# EAGLE design XStepperLCD (EAGLE 6.4)
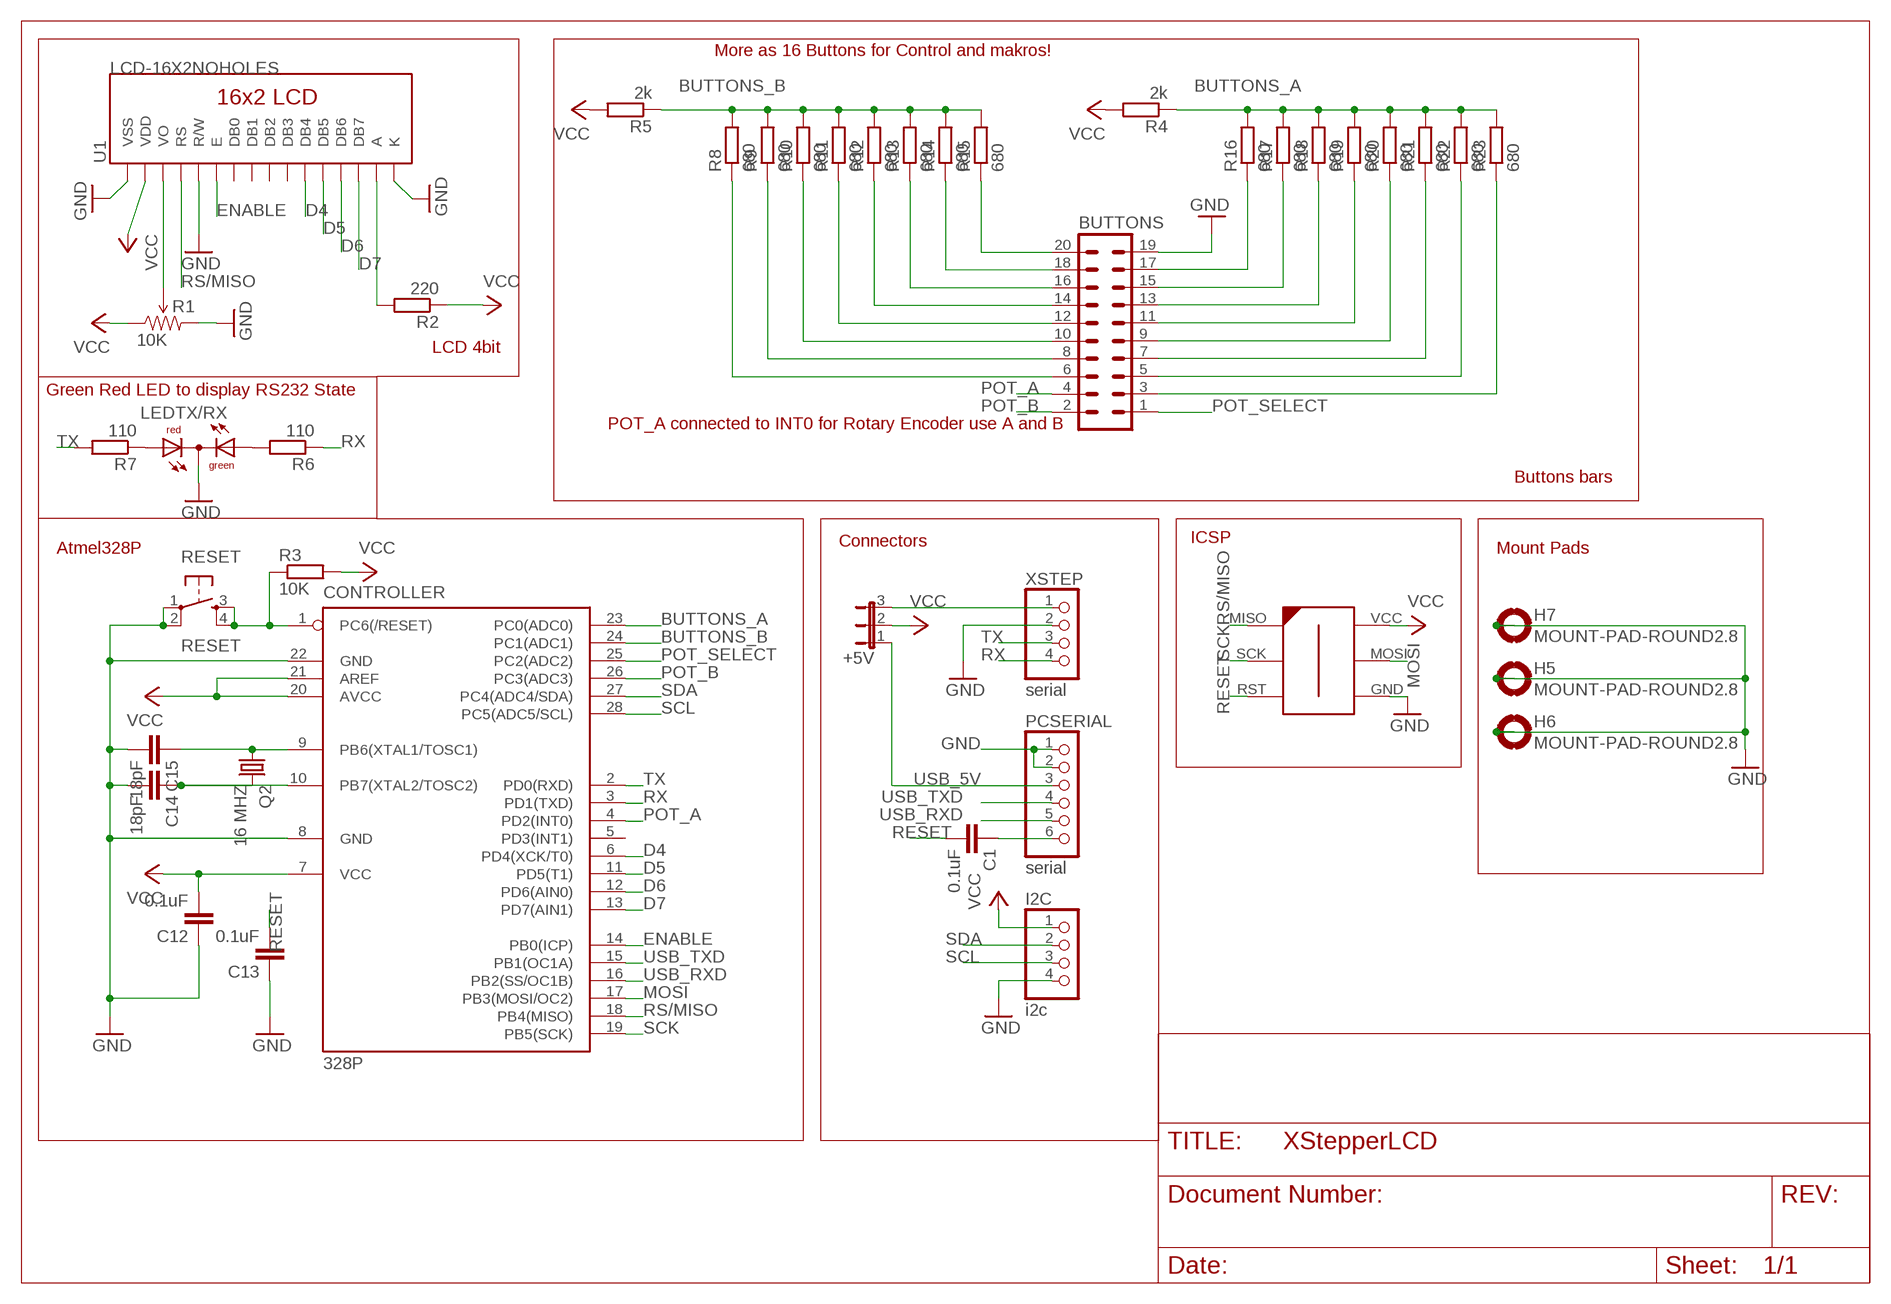
[diagram p0: schematic, sheet 1]

## Parts
328P  CONTROLLER  MEGA8-P  [DIL28-3]
+5V  JP2E  [JP2]
BUTTONS  ML20  [ML20]
C1  0.1uF  C-EUC1206  [C1206]
C12  0.1uF  C-EUC1206K  [C1206K]
C13  0.1uF  C-EUC1206  [C1206]
C14  18pF  C-EU025-025X050  [C025-025X050]
C15  18pF  C-EU025-025X050  [C025-025X050]
H5  MOUNT-PAD-ROUND2.8  [2,8-PAD]
H6  MOUNT-PAD-ROUND2.8  [2,8-PAD]
H7  MOUNT-PAD-ROUND2.8  [2,8-PAD]
I2C  i2c  PINHD-1X4/90  [1X04/90]
ICSP  ICSP  AVR-ISP-6-EDGE  [6PAD_ISP]
LEDTX/RX  DUOLED2X5  [DUOLED2X5]
PCSERIAL  serial  PINHD-1X6/90  [1X06/90]
Q2  16 MHZ  CRYSTALHC49S  [HC49/S]
R1  10K  TRIMPOT3362U-2  [3362U-2]
R2  220  R-EU_R1206  [R1206]
R3  10K  R-EU_R1206  [R1206]
R4  2k  R-EU_R1206  [R1206]
R5  2k  R-EU_R1206  [R1206]
R6  110  R-EU_R1206  [R1206]
R7  110  R-EU_R1206  [R1206]
R8  680  R-EU_R1206  [R1206]
R9  680  R-EU_R1206  [R1206]
R10  680  R-EU_R1206  [R1206]
R11  680  R-EU_R1206  [R1206]
R12  680  R-EU_R1206  [R1206]
R13  680  R-EU_R1206  [R1206]
R14  680  R-EU_R1206  [R1206]
R15  680  R-EU_R1206  [R1206]
R16  680  R-EU_R1206  [R1206]
R17  680  R-EU_R1206  [R1206]
R18  680  R-EU_R1206  [R1206]
R19  680  R-EU_R1206  [R1206]
R20  680  R-EU_R1206  [R1206]
R21  680  R-EU_R1206  [R1206]
R22  680  R-EU_R1206  [R1206]
R23  680  R-EU_R1206  [R1206]
RESET  RESET  TAC_SWITCHPTH  [TACTILE-PTH]
U1  LCD-16X2NOHOLES  [LCD-16X2_NOHOLES]
XSTEP  serial  PINHD-1X4/90  [1X04/90]

## Nets
BUTTONS_A: 328P.23(PC0(ADC0)) R4.1 R16.2 R17.2 R18.2 R19.2 R20.2 R21.2 R22.2 R23.2
BUTTONS_B: 328P.24(PC1(ADC1)) R5.1 R8.2 R9.2 R10.2 R11.2 R12.2 R13.2 R14.2 R15.2
D4: 328P.6(PD4(XCK/T0)) U1.11(DB4)
D5: 328P.11(PD5(T1)) U1.12(DB5)
D6: 328P.12(PD6(AIN0)) U1.13(DB6)
D7: 328P.13(PD7(AIN1)) U1.14(DB7)
ENABLE: 328P.14(PB0(ICP)) U1.6(E)
GND: 328P.8(GND) 328P.22(GND) BUTTONS.19 C12.1 C13.1 C14.2 C15.2 H5.B2,8(MOUNT) H6.B2,8(MOUNT) H7.B2,8(MOUNT) I2C.4 ICSP.GND LEDTX/RX.K(C) PCSERIAL.1 PCSERIAL.2 R1.3(CW) RESET.1 RESET.2 U1.1(VSS) U1.5(R/W) U1.16(K) XSTEP.2
MOSI: 328P.17(PB3(MOSI/OC2)) ICSP.MOSI
N$1: R1.2(WIPER) U1.3(VO)
N$2: R2.2 U1.15(A)
N$4: BUTTONS.13 R18.1
N$5: BUTTONS.15 R17.1
N$6: BUTTONS.17 R16.1
N$7: BUTTONS.6 R8.1
N$8: BUTTONS.8 R9.1
N$9: BUTTONS.3 R23.1
N$10: BUTTONS.5 R22.1
N$11: BUTTONS.10 R10.1
N$12: BUTTONS.12 R11.1
N$13: BUTTONS.14 R12.1
N$14: C1.1 PCSERIAL.6
N$15: BUTTONS.16 R13.1
N$16: BUTTONS.7 R21.1
N$17: BUTTONS.9 R20.1
N$18: BUTTONS.11 R19.1
N$19: BUTTONS.18 R14.1
N$20: BUTTONS.20 R15.1
N$21: LEDTX/RX.AG R6.2
N$22: LEDTX/RX.AR R7.1
N$33: 328P.9(PB6(XTAL1/TOSC1)) C15.1 Q2.1
N$34: 328P.10(PB7(XTAL2/TOSC2)) C14.1 Q2.2
POT_A: 328P.4(PD2(INT0)) BUTTONS.4
POT_B: 328P.26(PC3(ADC3)) BUTTONS.2
POT_SELECT: 328P.25(PC2(ADC2)) BUTTONS.1
RESET: 328P.1(PC6(/RESET)) C1.2 C13.2 ICSP.RST R3.1 RESET.3 RESET.4
RS/MISO: 328P.18(PB4(MISO)) ICSP.MISO U1.4(RS)
RX: 328P.3(PD1(TXD)) R6.1 XSTEP.4
SCK: 328P.19(PB5(SCK)) ICSP.SCK
SCL: 328P.28(PC5(ADC5/SCL)) I2C.3
SDA: 328P.27(PC4(ADC4/SDA)) I2C.2
TX: 328P.2(PD0(RXD)) R7.2 XSTEP.3
USB_5V: +5V.1 PCSERIAL.3
USB_RXD: 328P.16(PB2(SS/OC1B)) PCSERIAL.5
USB_TXD: 328P.15(PB1(OC1A)) PCSERIAL.4
VCC [power]: 328P.7(VCC) 328P.20(AVCC) 328P.21(AREF) +5V.2 C12.2 I2C.1 ICSP.VCC R1.1(CCW) R2.1 R3.2 R4.2 R5.2 U1.2(VDD)
XSTEP_5V: +5V.3 XSTEP.1
Unconnected: 328P.5(PD3(INT1)) U1.7(DB0) U1.8(DB1) U1.9(DB2) U1.10(DB3)

## Notes on the sheet
- More as 16 Buttons for Control and makros!
- LCD 4bit
- Green Red LED to display RS232 State
- POT_A connected to INT0 for Rotary Encoder use A and B
- Buttons bars
- Connectors | ICSP
- Atmel328P | Mount Pads

## Library data of the parts
328P = Bibsatmel:MEGA8-P: MICROCONTROLLER 8 Kbytes FLASH, 1 kbytes SRAM, 512 bytes EEPROM, USART, 4-channel 10 bit ADC, 2-channel 8 bit ADC Pin compatible with Atmega48, ATMega88, ATMega168 Source: avr.lbr; OC_FARNELL: unknown; OC_NEWARK: unknown
+5V = jumper:JP2E: JUMPER
BUTTONS = con-ml:ML20: HARTING; OC_FARNELL: unknown; OC_NEWARK: unknown
C1 C12-C15 = resistor:C-EU: CAPACITOR, European symbol
H5-H7 = holes:MOUNT-PAD-ROUND: MOUNTING PAD, round
I2C XSTEP = pinhead:PINHD-1X4: PIN HEADER
ICSP = avr-7:AVR-ISP-6-EDGE: 6 pin edge connector for ISP with ATMEL MCUs. Developed by Craig Moates (craig at moates dot net). Library by David Blundell (blundar at gmail dot com). Often, even a 6 pin header is really inconvenient for board layout and/or production. This SMD-only header is our de-facto standard for using an edge connector for programming with the help of a 6pin/10pin to edge card adapter.
LEDTX/RX = led:DUOLED2X5: DUO LED 2 colors, 2.5 x 5 mm, recangle
PCSERIAL = pinhead:PINHD-1X6: PIN HEADER
Q2 = crystal:CRYSTAL: CRYSTAL; OC_FARNELL: 1667008; OC_NEWARK: unknown
R1 = SparkFun-Electromechanical:TRIMPOT: Various small potentiometers for "set-and-forget" applications
R2-R23 = resistor:R-EU_: RESISTOR, European symbol
RESET = SparkFun:TAC_SWITCH: Momentary Switch Button commonly used for reset or general input. Spark Fun Electronics SKU : COM-00097
U1 = SparkFun-Displays:LCD-16X2: Standard text-only 16x2 parallel input LCD

## Net classes
0 default: width 0.254 mm, clearance 0.203 mm
1 power: width 0.406 mm, clearance 0.305 mm

## Board
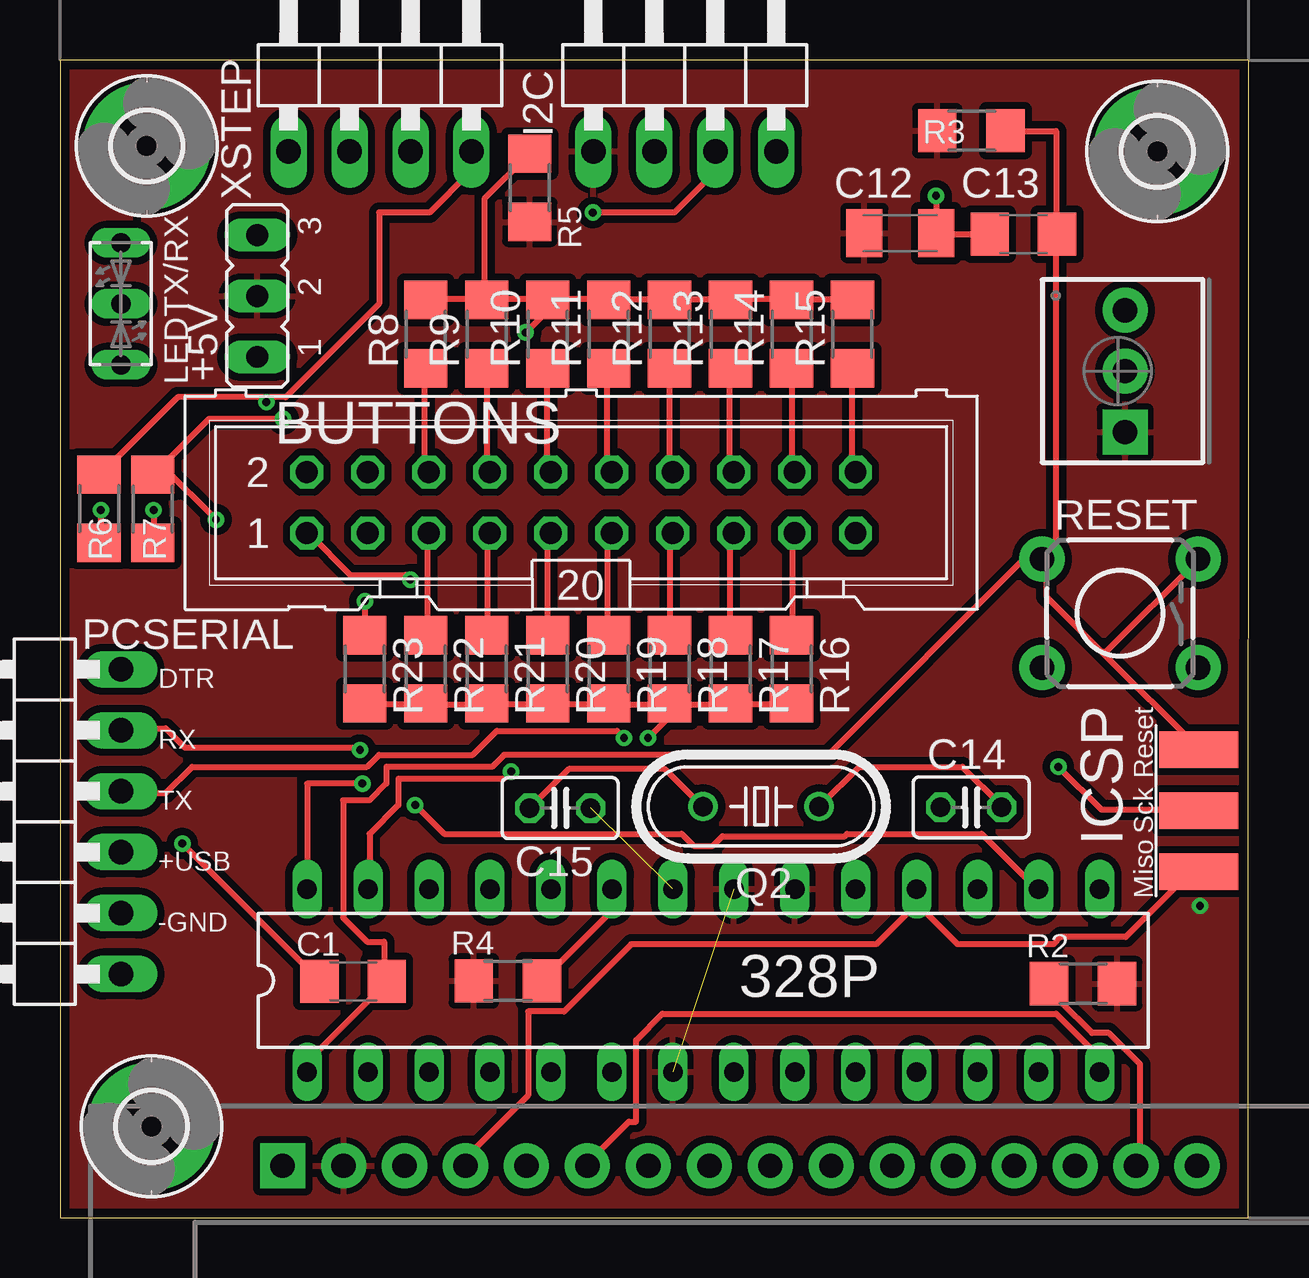
[diagram p1: board, top side]
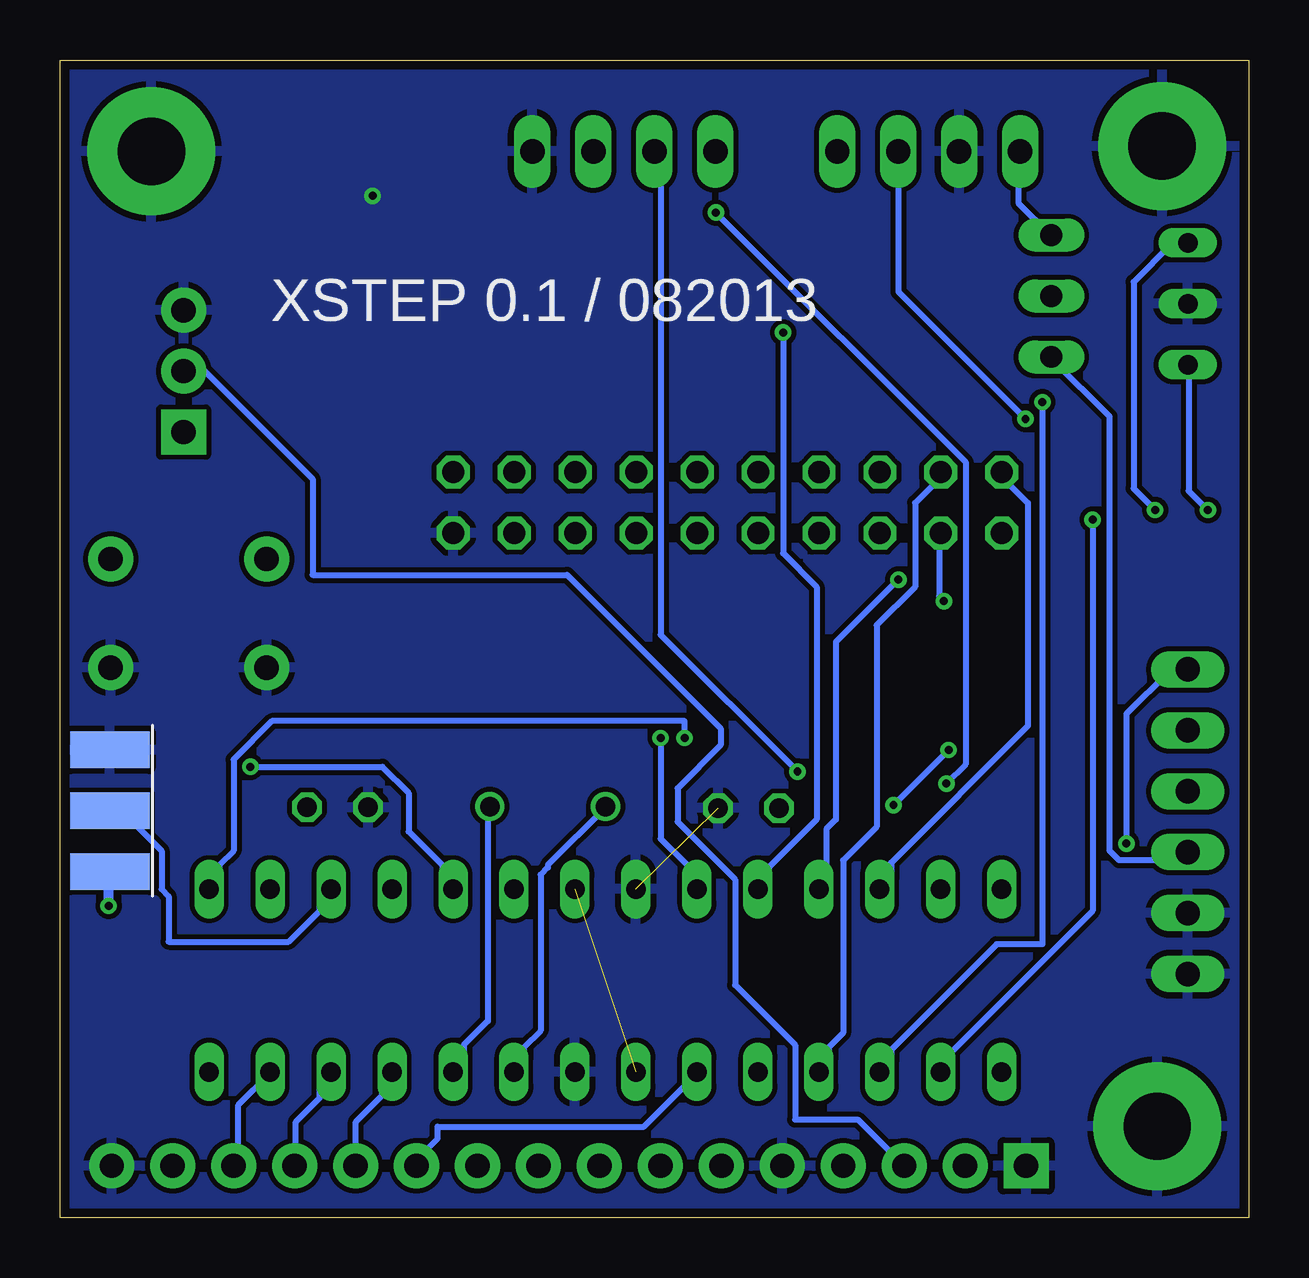
[diagram p2: board, bottom side, seen from below]

Size 49.53 x 48.26 mm. Coordinates in mm from the lower left corner, seen from the top.
Outline: 0,0 49.51,0 49.53,48.26 0,48.25 0,0
Copper layers (1*16): Top 0.0356mm / dielectric 1.5011mm / Bottom 0.0356mm
Design rules "LaenPCBOrder": minimum track width 6mil, minimum drill 13mil, track to track 6mil, track to pad 6mil, pad to pad 6mil, via to via 6mil, smd to smd 6mil, copper to edge 15mil, drill to drill 6mil, minimum pad ring 7mil, minimum via ring 7mil, stop-mask expansion 4mil, vias tented up to drill 0mil, thermal gap 10mil

### Footprints (pad centres in the part's own frame; a part is rotated, then mirrored left to right if it is on the bottom)
DIL28-3 = drill 0.813 long: 1 -16.51,-3.81; 2 -13.97,-3.81; 3 -11.43,-3.81; 4 -8.89,-3.81; 5 -6.35,-3.81; 6 -3.81,-3.81; 7 -1.27,-3.81; 8 1.27,-3.81; 9 3.81,-3.81; 10 6.35,-3.81; 11 8.89,-3.81; 12 11.43,-3.81; 13 13.97,-3.81; 14 16.51,-3.81; 15 16.51,3.81; 16 13.97,3.81; 17 11.43,3.81; 18 8.89,3.81; 19 6.35,3.81; 20 3.81,3.81; 21 1.27,3.81; 22 -1.27,3.81; 23 -3.81,3.81; 24 -6.35,3.81; 25 -8.89,3.81; 26 -11.43,3.81; 27 -13.97,3.81; 28 -16.51,3.81
JP2 = drill 0.914 long: 1 -2.54,0; 2 0,0; 3 2.54,0
ML20 = drill 0.914 octagon: 1 -11.43,-1.27; 2 -11.43,1.27; 3 -8.89,-1.27; 4 -8.89,1.27; 5 -6.35,-1.27; 6 -6.35,1.27; 7 -3.81,-1.27; 8 -3.81,1.27; 9 -1.27,-1.27; 10 -1.27,1.27; 11 1.27,-1.27; 12 1.27,1.27; 13 3.81,-1.27; 14 3.81,1.27; 15 6.35,-1.27; 16 6.35,1.27; 17 8.89,-1.27; 18 8.89,1.27; 19 11.43,-1.27; 20 11.43,1.27
C1206 = smd 1.6 x 1.8: 1 -1.4,0; 2 1.4,0
C1206K = smd 1.5 x 2: 1 -1.5,0; 2 1.5,0
C025-025X050 = drill 0.813 octagon: 1 -1.27,0; 2 1.27,0
2,8-PAD = drill 2.8 pad 5.334: B2,8 0,0
1X04/90 = drill 1.016 long: 1 -3.81,-3.81; 2 -1.27,-3.81; 3 1.27,-3.81; 4 3.81,-3.81
6PAD_ISP = smd 1.524 x 3.302 bottom: GND 2.54,0; MOSI 0,0; VCC -2.54,0 | smd 1.524 x 3.302: MISO -2.54,0; RST 2.54,0; SCK 0,0
DUOLED2X5 = drill 0.813 long: AG -2.54,0; AR 2.54,0; K 0,0
1X06/90 = drill 1.016 long: 1 -6.35,-3.81; 2 -3.81,-3.81; 3 -1.27,-3.81; 4 1.27,-3.81; 5 3.81,-3.81; 6 6.35,-3.81
HC49/S = drill 0.813: 1 -2.413,0; 2 2.413,0
3362U-2 = drill 1.016 pad 1.88 square: 1 -2.54,-0.305 | drill 1.016 pad 1.88: 2 0,-0.305; 3 2.54,-0.305
R1206 = smd 1.6 x 1.803: 1 -1.422,0; 2 1.422,0
TACTILE-PTH = drill 1.016 pad 1.88: 1 -3.251,2.261; 2 3.251,2.261; 3 -3.251,-2.261; 4 3.251,-2.261
LCD-16X2_NOHOLES = drill 1.016 pad 1.88 square: 1 -32,15.5 | drill 1.016 pad 1.88: 2 -29.46,15.5; 3 -26.92,15.5; 4 -24.38,15.5; 5 -21.84,15.5; 6 -19.3,15.5; 7 -16.76,15.5; 8 -14.22,15.5; 9 -11.68,15.5; 10 -9.14,15.5; 11 -6.6,15.5; 12 -4.06,15.5; 13 -1.52,15.5; 14 1.02,15.5; 15 3.56,15.5; 16 6.1,15.5

### Placement (x,y rotation side)
328P  26.8,9.89 0 top
+5V  8.22,38.42 90 top
BUTTONS  21.71,29.8 0 top
C1  12.21,9.85 0 top
C12  35.02,41.05 180 top
C13  40.14,40.99 0 top
C14  37.97,17.11 180 top
C15  20.84,17.07 0 top
H5  3.61,44.67 0 top
H6  45.72,44.45 0 top
H7  3.81,3.81 0 top
I2C  26.04,48.26 0 top
ICSP  47.45,16.96 90 top
LEDTX/RX  2.54,38.1 90 top
PCSERIAL  -1.27,16.51 90 top
Q2  29.21,17.14 0 top
R1  44.08,35.29 90 top
R2  42.62,9.76 180 top
R3  37.98,45.31 180 top
R4  18.66,9.88 180 top
R5  19.57,42.93 270 top
R6  1.63,29.55 270 top
R7  3.86,29.55 90 top
R8  15.24,36.83 90 top
R9  17.78,36.83 90 top
R10  20.32,36.83 90 top
R11  22.86,36.83 90 top
R12  25.4,36.83 90 top
R13  27.94,36.83 90 top
R14  30.48,36.83 90 top
R15  33.02,36.83 90 top
R16  30.48,22.86 270 top
R17  27.94,22.86 270 top
R18  25.4,22.86 270 top
R19  22.86,22.86 270 top
R20  20.32,22.86 270 top
R21  17.78,22.86 270 top
R22  15.24,22.86 270 top
R23  12.7,22.86 270 top
RESET  44.17,25.2 180 top
U1  41.27,-13.34 0 top
XSTEP  13.34,48.26 0 top

### Tracks (layer width: path | path; a pad name or v marks a point on that pad's centre or on a via)
BUTTONS_A  (via drill 0.33)
  Top 0.254: R4.1 20.1,9.9 22.9,12.7 22.9,13.7 328P.23 | R23.2 12.7,21.4 15.2,21.4 R22.2 15.3,21.4 17.7,21.4 R21.2 17.9,21.4 20.2,21.4 R20.2 20.4,21.4 22.8,21.4 R19.2 22.9,21.4 25.4,21.4 R18.2 | R16.2 30.4,21.4 28,21.4 R17.2 27.9,21.4 25.5,21.4 R18.2 | v24.5,20 25.8,21.3 R18.2
  Bottom 0.254: v24.5,20 24.5,15.8 23.4,14.7 23.4,14.1 328P.23
BUTTONS_B  (via drill 0.33)
  Top 0.254: R8.2 15.3,38.3 17.7,38.3 R9.2 | R5.1 19.5,44.3 17.7,42.5 17.7,38.4 R9.2 | R15.2 33,38.3 30.5,38.3 R14.2 30.4,38.3 28,38.3 R13.2 27.9,38.3 25.5,38.3 R12.2 25.4,38.3 22.9,38.3 R11.2 22.8,38.3 20.4,38.3 R10.2 | v19.4,36.9 20.7,38.2 R10.2 | R9.2 17.8,38.3 20.2,38.3 R10.2
  Bottom 0.254: v19.4,36.9 19.4,27.7 18,26.3 18,16.6 20,14.6 20,14.1 20.4,13.7 328P.24
D4
  Bottom 0.254: 328P.6 23,6 25.2,3.8 33.8,3.8 33.8,3.3 34.6,2.5 34.6,2.2 U1.11
D5
  Bottom 0.254: 328P.11 35.7,6 36.1,5.6 36.1,5.1 37.2,4 37.2,2.2 U1.12
D6
  Bottom 0.254: 328P.12 38.3,6 38.7,5.6 38.7,5 39.7,4 39.7,2.2 U1.13
D7
  Bottom 0.254: 328P.13 40.8,6 42.1,4.7 42.1,2.3 42.2,2.2 U1.14
ENABLE
  Top 0.254: 328P.14 43.3,6.1 43.3,7.1 42.9,7.1 41.5,8.5 25.1,8.5 24,7.4 24,4 23.7,4 21.9,2.2 U1.6
GND  (via drill 0.33)  (1 unrouted)
  Top 0.254: C13.1 38.7,41 36.6,41 C12.1 36.5,41.1 v36.5,42.6
  pour Bottom: 0,0 49.53,0 49.53,48.26 0,48.26
MOSI
  Bottom 0.254: 328P.17 38.3,13.7 38.7,13.3 38.7,12.8 40,11.5 45,11.5 45,13.4 45.3,13.7 45.3,15.3 46.9,16.9 47.4,16.9 ICSP.MOSI
N$1
  Bottom 0.254: U1.3 14.4,2.2 16.3,4.1 18.9,4.1 18.9,7.2 21.4,9.7 21.4,14.1 23.8,16.5 23.8,17.9 22,19.7 22,20.4 28.4,26.8 39,26.8 39,30.8 43.5,35.3 44.3,35.3 R1.2
N$2
  Top 0.254: R2.2 41.3,9.7 41.3,9 41.7,9 43,7.7 43.7,7.7 45,6.4 45,2.2 44.9,2.2 U1.15
N$4
  Top 0.254: R18.1 25.4,28.5 25.5,28.5 BUTTONS.13
N$5
  Top 0.254: R17.1 27.9,24.3 27.9,28.5 28,28.5 BUTTONS.15
N$6
  Top 0.254: R16.1 30.5,24.3 30.5,28.5 30.6,28.5 BUTTONS.17
N$7
  Top 0.254: R8.1 15.2,35.4 15.2,31.1 15.3,31.1 BUTTONS.6
N$8
  Top 0.254: R9.1 17.8,35.4 17.8,31.1 17.9,31.1 BUTTONS.8
N$9  (via drill 0.33)
  Top 0.254: v12.7,25.7 R23.1
  Bottom 0.254: v12.7,25.7 12.9,25.9 12.9,28.5 BUTTONS.3
N$10
  Top 0.254: R22.1 15.3,24.3 15.3,28.5 BUTTONS.5
N$11
  Top 0.254: R10.1 20.3,35.4 20.3,31.1 20.4,31.1 BUTTONS.10
N$12
  Top 0.254: R11.1 22.8,35.4 22.8,31.1 22.9,31.1 BUTTONS.12
N$13
  Top 0.254: R12.1 25.4,31.1 25.5,31.1 BUTTONS.14
N$14  (via drill 0.33)
  Top 0.254: v5.1,15.6 10.8,9.9 C1.1
  Bottom 0.254: v5.1,15.6 5.1,21 3.3,22.8 2.6,22.8 PCSERIAL.6
N$15
  Top 0.254: R13.1 27.9,35.4 27.9,31.1 28,31.1 BUTTONS.16
N$16
  Top 0.254: R21.1 17.8,24.3 17.8,28.5 17.9,28.5 BUTTONS.7
N$17
  Top 0.254: R20.1 20.3,24.3 20.3,28.5 20.4,28.5 BUTTONS.9
N$18
  Top 0.254: R19.1 22.8,24.3 22.8,28.5 22.9,28.5 BUTTONS.11
N$19
  Top 0.254: R14.1 30.5,35.4 30.5,31.1 30.6,31.1 BUTTONS.18
N$20
  Top 0.254: R15.1 33,35.4 33,31.1 33.1,31.1 BUTTONS.20
N$21  (via drill 0.33)
  Top 0.254: v1.7,29.5 1.7,28.2 R6.2
  Bottom 0.254: v1.7,29.5 2.5,30.3 2.5,35.5 LEDTX/RX.AG
N$22  (via drill 0.33)
  Top 0.254: v3.9,29.5 3.9,28.2 R7.1
  Bottom 0.254: v3.9,29.5 4.8,30.4 4.8,39 3.2,40.6 2.6,40.6 LEDTX/RX.AR
N$33
  Top 0.254: C15.1 19.6,17.1 21.2,18.7 25.2,18.7 26.7,17.2 Q2.1
  Bottom 0.254: 328P.9 30.6,6.1 30.2,6.5 30.2,7.1 29.5,7.8 29.5,14.3 29.2,14.6 29.2,14.7 26.8,17.1 Q2.1
N$34
  Top 0.254: C14.1 39.2,17.2 37.6,18.8 33.3,18.8 31.7,17.2 Q2.2
  Bottom 0.254: 328P.10 33.1,6.1 32.7,6.5 32.7,7.2 31.7,8.2 31.7,17.1 Q2.2
POT_A
  Bottom 0.254: 328P.4 17.9,6.1 17.5,6.5 17.5,7.1 16.9,7.7 16.9,14.9 15.5,16.3 15.5,24.7 13.9,26.3 13.9,29.8 12.9,30.8 12.9,31 BUTTONS.4
POT_B
  Bottom 0.254: 328P.26 15.3,13.7 14.9,14.1 14.9,14.8 9.2,20.5 9.2,29.8 10.2,30.8 10.2,31 BUTTONS.2
POT_SELECT  (via drill 0.33)
  Top 0.254: v14.6,26.6 14.4,26.8 12.1,26.8 10.4,28.5 10.3,28.5 BUTTONS.1
  Bottom 0.254: v14.6,26.6 17.2,24 17.2,16.6 17.6,16.2 17.6,14 328P.25
RESET
  Top 0.254: 328P.1 10.3,6.1 10.3,6.5 13.6,9.8 C1.2 13.5,9.9 13.5,11.5 12.8,11.5 11.8,12.5 11.8,17.4 12.9,17.4 13.6,18.1 13.6,18.8 18,18.8 18.5,19.3 32,19.3 40.2,27.5 40.8,27.5 RESET.4 | R3.1 41.5,45.3 41.5,41 C13.2 41.5,40.9 41.5,27.5 41.1,27.5 RESET.4 | 43.45,23.55 41.1,25.9 41.1,27.4 41,27.4 RESET.4 | 43.45,23.55 47.4,19.6 ICSP.RST | RESET.3 47.4,27.4 43.6,23.6 43.5,23.6 43.45,23.55
RS/MISO
  Top 0.254: ICSP.MISO 47.4,14.4 47.1,14.4 44.4,11.7 41.7,11.7 41.4,11.4 37.4,11.4 36.1,12.7 35.7,12.7 328P.18 35.6,12.8 35.4,12.8 34,11.4 23.8,11.4 21,8.6 19.5,8.6 19.5,5.1 17.3,2.9 16.9,2.9 16.9,2.2 U1.4
RX  (via drill 0.33)
  Top 0.254: 8.6,34.2 9.4,34.2 13.3,38.1 13.3,41.9 15.4,41.9 17.1,43.6 17.1,44.4 XSTEP.4 | 8.6,34.2 4.9,34.2 1.7,31 R6.1 | v8.6,34 8.6,34.2
  Bottom 0.254: v8.6,34 8.6,11.4 10.5,11.4 14.9,7 14.9,6.5 15.3,6.1 328P.3
SCK  (via drill 0.33)
  Top 0.254: v41.6,18.8 43.4,17 47.4,17 ICSP.SCK
  Bottom 0.254: v41.6,18.8 36.1,18.8 35,17.7 35,16.1 33.6,14.7 33.6,14.1 33.2,13.7 328P.19
SCL  (via drill 0.33)
  Top 0.254: v12.6,18.1 10.3,18.1 328P.28 | v22.2,41.9 25.6,41.9 27.3,43.6 27.3,44.4 I2C.3
  Bottom 0.254: v12.6,18.1 11.8,18.9 11.8,31.5 v22.2,41.9
SDA  (via drill 0.33)
  Top 0.254: v18.8,18.6 18.5,18.3 14.1,18.3 14.1,17.2 12.9,16 12.9,13.7 328P.27
  Bottom 0.254: v18.8,18.6 24.5,24.3 24.5,43 24.7,43.2 24.7,44.4 I2C.2
TX  (via drill 0.33)
  Top 0.254: v9.3,33.3 6.2,33.3 3.9,31 R7.2 4.3,31.3 v6.5,29.1
  Bottom 0.254: v9.3,33.3 14.6,38.6 14.6,44.4 XSTEP.3 | v6.5,29.1 6.5,12.8 12.4,6.9 12.4,6.5 12.8,6.1 328P.2
USB_5V
  Bottom 0.254: +5V.1 8.2,35.8 5.8,33.4 5.8,15.3 5.4,14.9 2.6,14.9 2.6,15.2 PCSERIAL.3
USB_RXD  (via drill 0.33)
  Top 0.254: v14.8,17.2 16,16 25.9,16 26.4,15.5 27.2,15.5 27.6,15.9 32.7,15.9 32.8,16 38.4,16 40.7,13.7 328P.16 | v12.5,19.5 12.4,19.6 5.2,19.6 4.4,20.4 2.6,20.4 PCSERIAL.5
  Bottom 0.254: v12.5,19.5 v14.8,17.2
USB_TXD  (via drill 0.33)
  Top 0.254: v23.5,20 23.2,20.3 18.2,20.3 17.2,19.3 13.3,19.3 12.8,18.8 5.5,18.8 4.4,17.7 2.6,17.7 PCSERIAL.4
  Bottom 0.254: v23.5,20 23.5,20.7 40.7,20.7 42.3,19.1 42.3,15.3 42.9,14.7 42.9,14.1 328P.15
VCC  (via drill 0.33)  (1 unrouted)
  Bottom 0.406: v47.5,13 47.5,14.4 ICSP.VCC
  pour Top: 0,48.26 49.53,48.26 49.53,0 0,0
XSTEP_5V
  Bottom 0.254: +5V.3 8.3,41 9.6,42.3 9.6,44.4 XSTEP.1

### Text on the board
tNames: DTR | RX | Reset | TX | ICSP | Sck | +USB | Miso | -GND
bNames: XSTEP 0.1 / 082013